# Altium schematic sheet USBINFRTransiever_USBUART.SchDoc
size 420 x 297 mm; DocumentNumber: ФНКЦ.542321.001 Э3; SheetNumber: 4; Format: A3
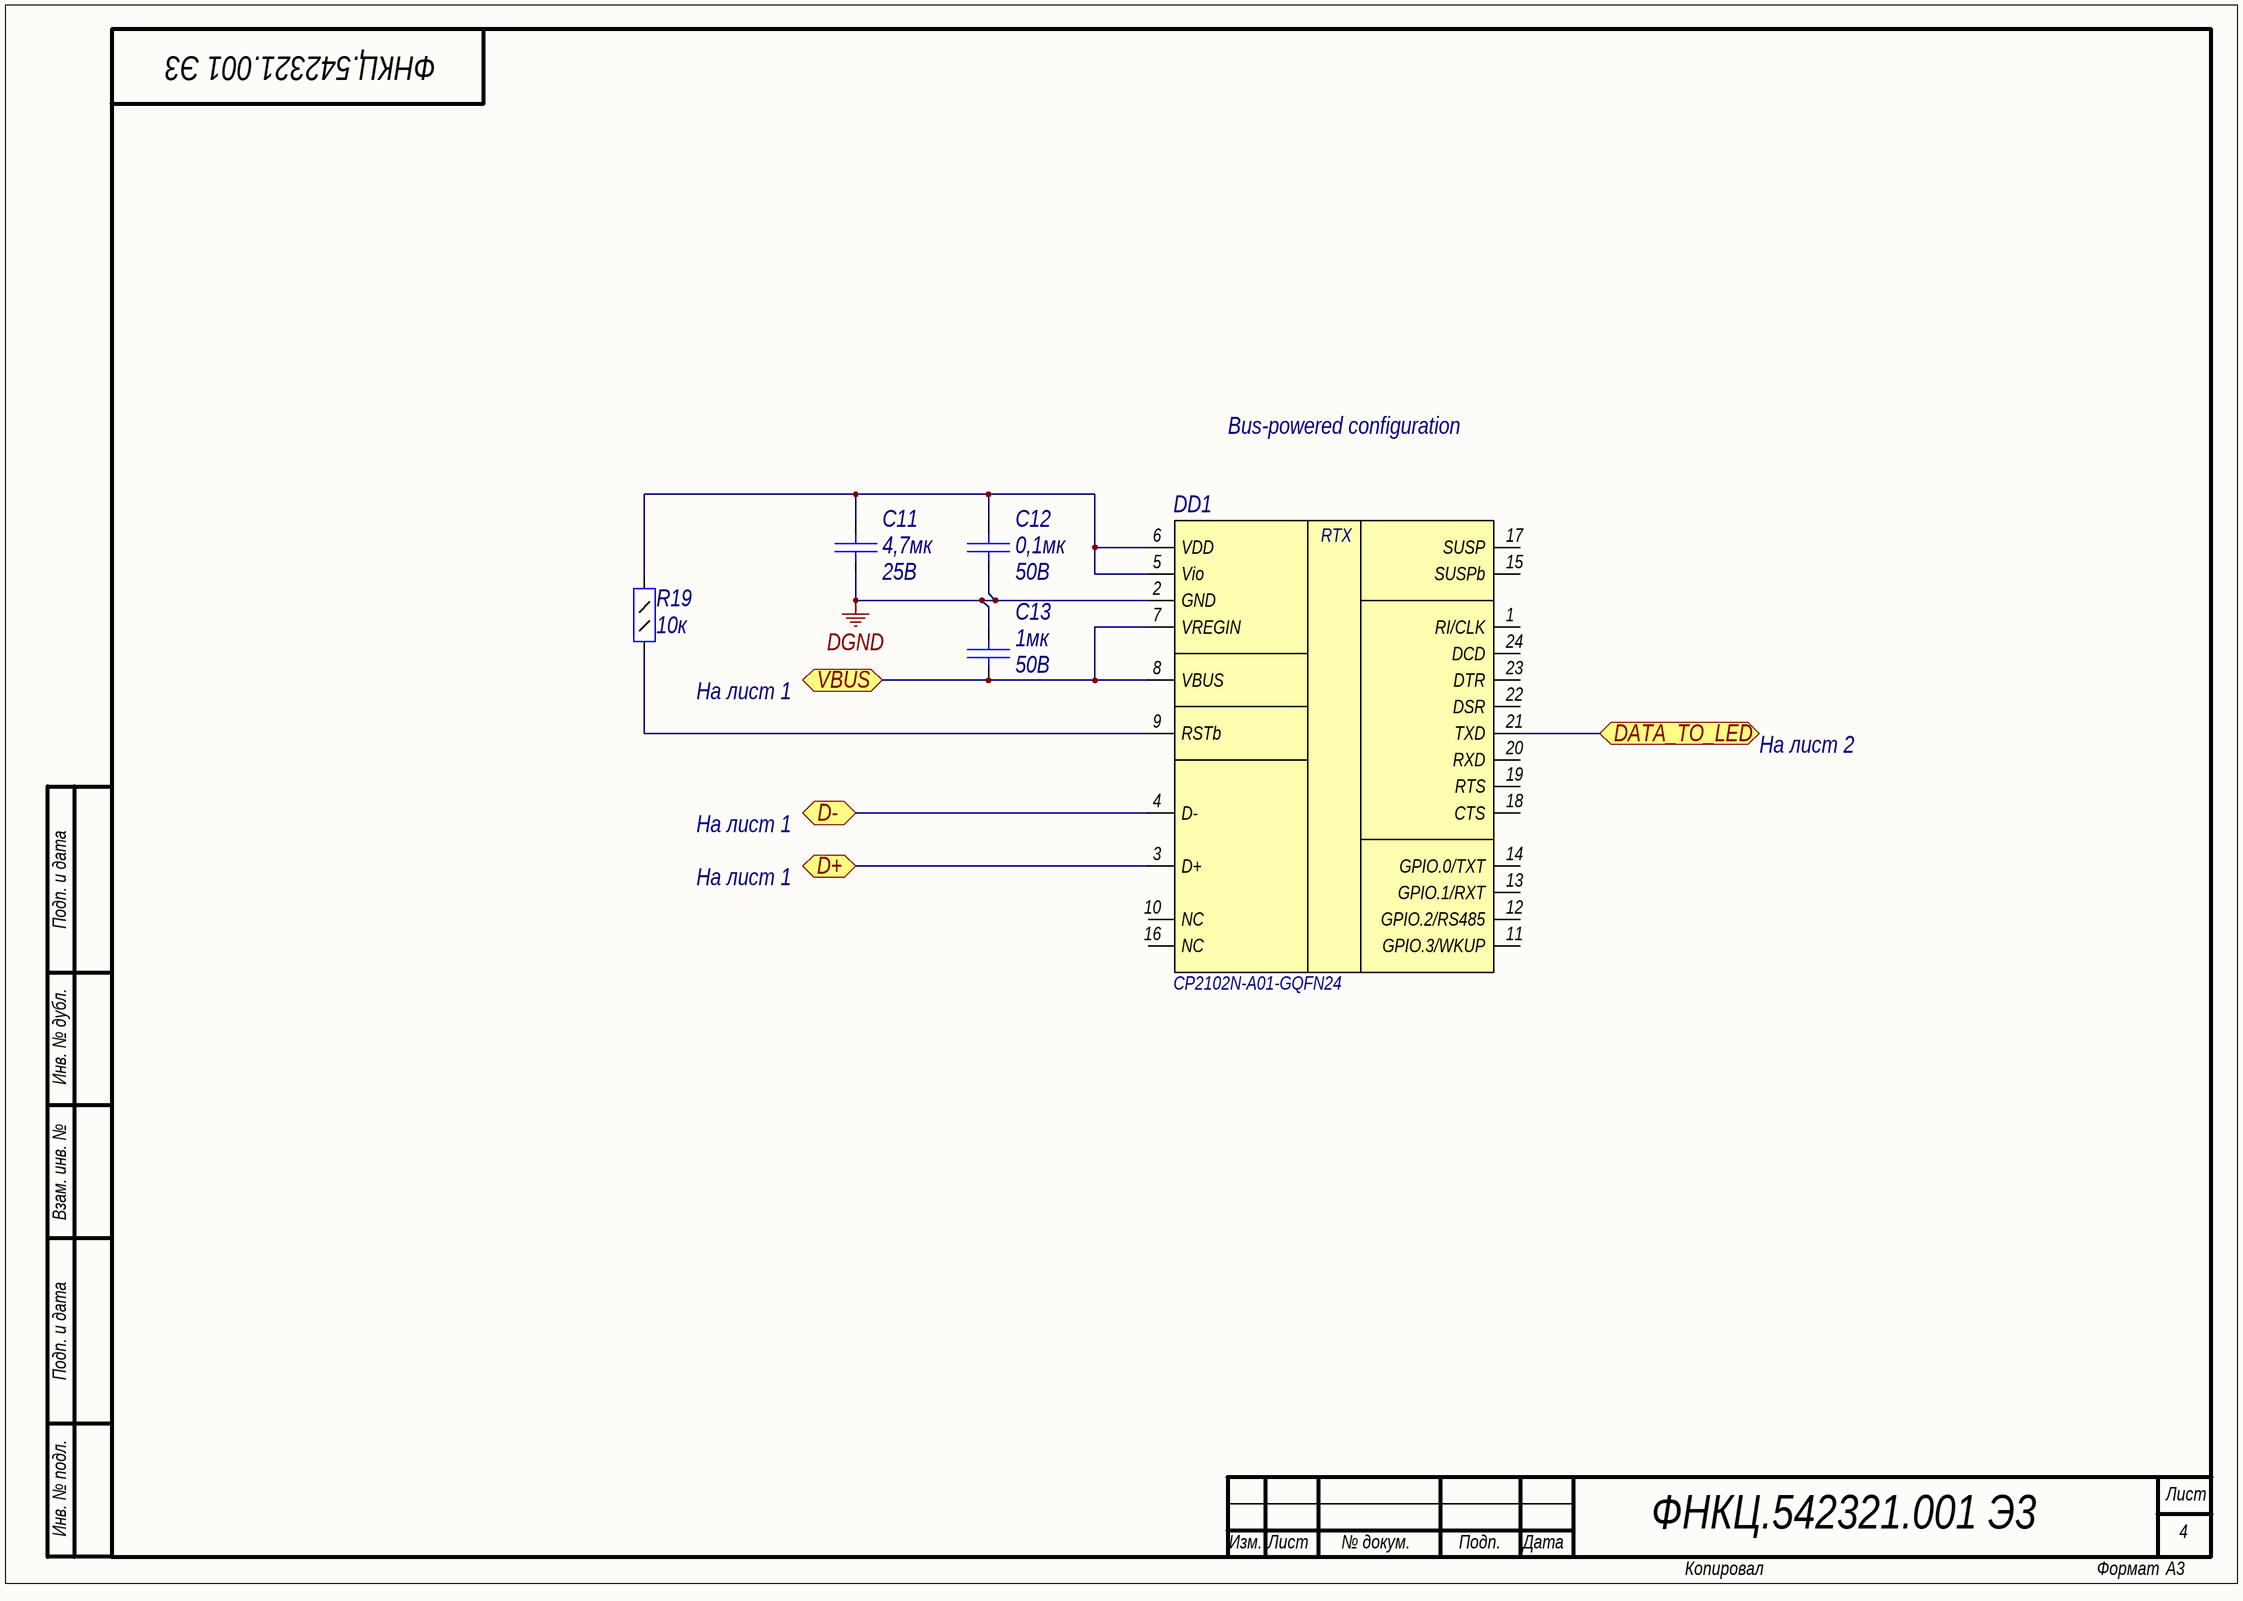
[diagram p0: USBINFRTransiever_USBUART.SchDoc]

## Parts
C11  value 4,7мк  Voltage: 25B  [C0805]  (hidden comment: Capacitor)
C12  value 0,1мк  Voltage: 50B  [C0805]  (hidden comment: Capacitor)
C13  value 1мк  Voltage: 50B  [C0805]  (hidden comment: Capacitor)
DD1  CP2102N-A01-GQFN24  [QFN24]
R19  value 10к  [R0805]  (hidden comment: Resistor_0,125Вт)

## Ports
D+, D-, DATA_TO_LED, VBUS

## Nets
DGND: C11.1 C12.1 C13.2 DD1.2(GND)
D+: DD1.3(D+) ; port D+
D-: DD1.4(D-) ; port D-
DATA_TO_LED: DD1.21(TXD) ; port DATA_TO_LED
VBUS: C13.1 DD1.7(VREGIN) DD1.8(VBUS) ; port VBUS
NetC11_2: C11.2 C12.2 DD1.5(Vio) DD1.6(VDD) R19.2
NetDD1_9: DD1.9(RSTb) R19.1

Not connected (* = marked no-connect by the designer): DD1 1(RI/CLK) 10(NC) 11(GPIO.3/WKUP) 12(GPIO.2/RS485) 13(GPIO.1/RXT) 14(GPIO.0/TXT) 15(SUSPb) 16(NC) 17(SUSP) 18(CTS) 19(RTS) 20(RXD) 22(DSR) 23(DTR) 24(DCD)

## Notes on the sheet
- Bus-powered configuration
- На лист 1
- На лист 2
- Подп. и дата
- Инв. № дубл.
- Взам. инв. №
- Инв. № подл.
- Лист
- Изм.
- № докум.
- Подп.
- Дата
- Копировал
- Формат
- (in symbol interf18) RTX

## Library data of the parts
C11 = cap154: Конденсатор; Part Name: Ceramic; Manufacture: Murata; Part Number: GRM21BR61E475KA12L; id: cap154; TKE: X5R
C12 = cap142: Конденсатор; Part Name: Ceramic; Manufacture: Murata; Part Number: GRM21BR71H104K**; id: cap142; TKE: X7R
C13 = cap152: Конденсатор; Part Name: Ceramic; Manufacture: Murata; Part Number: GRM21BR71H105K; id: cap152; TKE: X7R
DD1 = interf18: USB-UART преобразователь; Manufacture: Silicon Laboratories; Type Supply: Single Polar; Current Consumption: 1,3mA...10mA; Power Supply: 3-3.6V; id: interf18; Part Name: USB - UART; Part Number: CP2102N-A01-GQFN24
R19 = res97: Резистор; Manufacture: Yageo; Part Number: RC0805FR-0710KL; id: res97; Accuracy: 1%; Part Name: Resistor; Power: 0,125Вт